# EAGLE design RELAY_BRD_V3 (EAGLE 7.4.0)
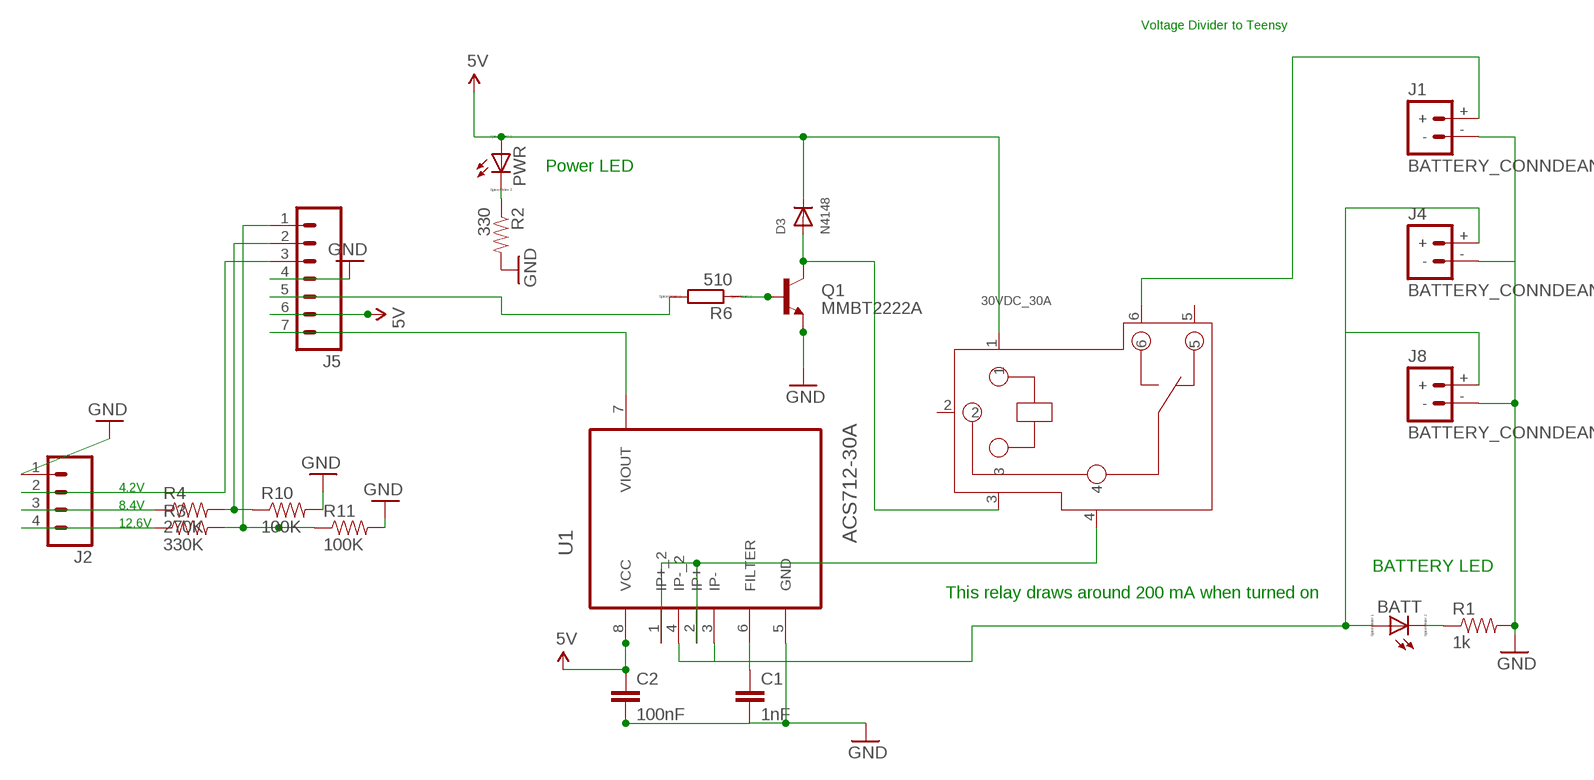
[diagram p0: schematic, sheet 1]

## Parts
30VDC_30A  RELAY-SLA-05VDC-SL-C  [6P-19.8H]
BATT  LED_E  [LED_1206]
C1  1nF  CAP1206  [1206]
C2  100nF  CAP1206  [1206]
D3  N4148  DIODEDO-1N4148  [DO-1N4148]
J1  BATTERY_CONNDEANS  [DEANS]
J2  M04POLAR  [MOLEX-1X4]
J4  BATTERY_CONNDEANS  [DEANS]
J5  M07LOCK_LONGPADS  [1X07_LOCK_LONGPADS]
J8  BATTERY_CONNDEANS  [DEANS]
PWR  LED_E  [LED_1206]
Q1  MMBT2222A  TRANSISTOR_NPNMMBT2222A  [SOT23-3]
R1  1k  RESISTOR1206  [1206]
R2  330  RESISTOR1206  [1206]
R3  330K  RESISTOR1206  [1206]
R4  270K  RESISTOR1206  [1206]
R6  510  RR1206  [R1206]
R10  100K  RESISTOR1206  [1206]
R11  100K  RESISTOR1206  [1206]
U1  ACS712-30A  ACS712ELCTR-20A-T  [SOIC127P600X175-8N]

## Nets
5V: 30VDC_30A.1 C2.1 D3.C J5.6 PWR.A U1.8(VCC)
11.1V_BATTERY: 30VDC_30A.6 J1.+
CURRENT_SENSE: J5.7 U1.7(VIOUT)
GND: C1.2 C2.2 J1.- J2.1 J4.- J5.4 J8.- Q1.2(E) R1.2 R2.2 R10.2 R11.2 U1.5(GND)
N$19: BATT.C R1.1
N$20: J5.5 R6.2
N$21: PWR.C R2.1
N$22: Q1.1(B) R6.1
N$23: 30VDC_30A.3 D3.A Q1.3(C)
N$24: J2.4 R3.1
N$26: BATT.A J4.+ J8.+ U1.3(IP-) U1.4(IP-_2)
N$27: J2.3 R4.1
N$68: C1.1 U1.6(FILTER)
N$69: J2.2 J5.3
N$70: 30VDC_30A.4 U1.1(IP+_2) U1.2(IP+)
N$84: J5.2 R4.2 R10.1
N$85: J5.1 R3.2 R11.1
Unconnected: 30VDC_30A.2 30VDC_30A.5

## Notes on the sheet
- Voltage Divider to Teensy
- Power LED
- 4.2V
- 8.4V
- 12.6V
- BATTERY LED
- This relay draws around 200 mA when turned on

## Library data of the parts
30VDC_30A = Grove ®C SPDT Relay(30A) v1.0:RELAY-SLA-05VDC-SL-C: · Up to 30A switching in SPST and 20A switching in spot arrangements. · Available as an open-frame relay, with a snap-on dust cover or with an immersion cleanable, plastic sealed case.
BATT PWR = eagle-ltspice:LED_E: LED Source: http://www.osram.convergy.de Source: www.luxeon.com Source: www.kingbright.com; SPICEMODEL: NONE; SPICEPREFIX: D; SPICETYPE: diode
C1 C2 = SparkFun-Capacitors:CAP: Capacitor Standard 0603 ceramic capacitor, and 0.1" leaded capacitor.
D3 = adafruit:DIODE: Diode SMADIODE - SMA Surface Mount Package 20V 1A Schottky Diode Digikey: 641-1014-6-ND DO-1N4148 - Through Hole Small Current Diode SOD-123 20V 1 A (.5mV Vf) Schottky Diode - Digikey: MBRX120TPMSCT-ND SOD-323 10V 570mA (.38mV Vf, 3ns) Schottky Diode - Digikey: ZLLS410CT-ND SOD-523 30V 30mA Schottky Diode (RB751S-40TE61) - Digikey: RB751S-40TE61CT-ND SOT23-R/W - SOT23 Package (R = Solder Paste/Reflow Ovens, W = Hand-Soldering) BAT54Film 40V 300mA - Digikey: 497-7162-1-ND
J1 J4 J8 = SparkFun-Connectors:BATTERY_CONN: Various footprints for battery connectors
J2 = SparkFun-Connectors:M04: Header 4 Standard 4-pin 0.1" header. Use with straight break away headers (SKU : PRT-00116), right angle break away headers (PRT-00553), swiss pins (PRT-00743), machine pins (PRT-00117), and female headers (PRT-00115). Molex polarized connector foot print use with SKU : PRT-08231 with associated crimp pins and housings. 1MM SMD Version SKU: PRT-10208
J5 = SparkFun-Connectors:M07: Header 7 Standard 7-pin 0.1" header. Use with straight break away headers (SKU : PRT-00116), right angle break away headers (PRT-00553), swiss pins (PRT-00743), machine pins (PRT-00117), and female headers (PRT-00115). NOTES ON THE VARIANTS LOCK and LOCK_LONGPADS... This footprint was designed to help hold the alignment of a through-hole component (i.e. 7-pin header) while soldering it into place. You may notice that each hole has been shifted either up or down by 0.005 of an inch from it's more standard position (which is usually a perfectly straight line). This slight alteration caused the pins (the squares in the middle) to touch the edges of the holes. Because they are alternating, it causes a "brace" to hold the header in place. 0.005 has proven to be the perfect amount of "off-center" position when using our standard breakaway headers. Although looks a little odd when you look at the bare footprint, once you have a header in there, the alteration is very hard to notice. Also, if you push a header all the way into place, it is covered up entirely on the bottom side. This idea of altering the position of holes to aid alignment will be further integrated into the Sparkfun Library for other footprints. It can help hold any component with 3 or more connection pins.
Q1 = SparkFun-DiscreteSemi:TRANSISTOR_NPN: Generic NPN BJT MMBT2222A - TRANS-08049 (SOT-23, 1A 40V) MPSA42 - TRANS-09116 (SOT-23, 500mA 300V) MMBT5088LT1G - TRANS-11160 (SOT-23, 50 mA 30V) BC547 - COM-08928 <http://www.sparkfun.com/products/8928> (TO-92 45V 100mA) (1.Collector 2.Base 3.Emitter) 2N3904 - COM-00521 <http://www.sparkfun.com/products/521> (TO-92 40V 200mA) (1.Emitter 2.Base 3.Collector) P2N2222A - COM-12852 <http://www.sparkfun.com/products/12852> (TO-92 40V 600mA) (1.Collector 2.Base 3.Emitter); PROD_ID: TRANS-08049
R1-R4 R10 R11 = SparkFun-Resistors:RESISTOR: Resistor Basic schematic elements and footprints for 0603, 1206, and PTH resistors.
R6 = eagle-ltspice:R: RESISTOR, European symbol; SPICEMODEL: NONE; SPICEPREFIX: R
U1 = Allegro_By_element14_Batch_1:ACS712ELCTR-20A-T: Linear Current Sensor; MPN: ACS712ELCTR-20A-T; OC_FARNELL: 1329624; OC_NEWARK: 31M3133; PACKAGE: SOIC-8; SUPPLIER: Allegro

## Board
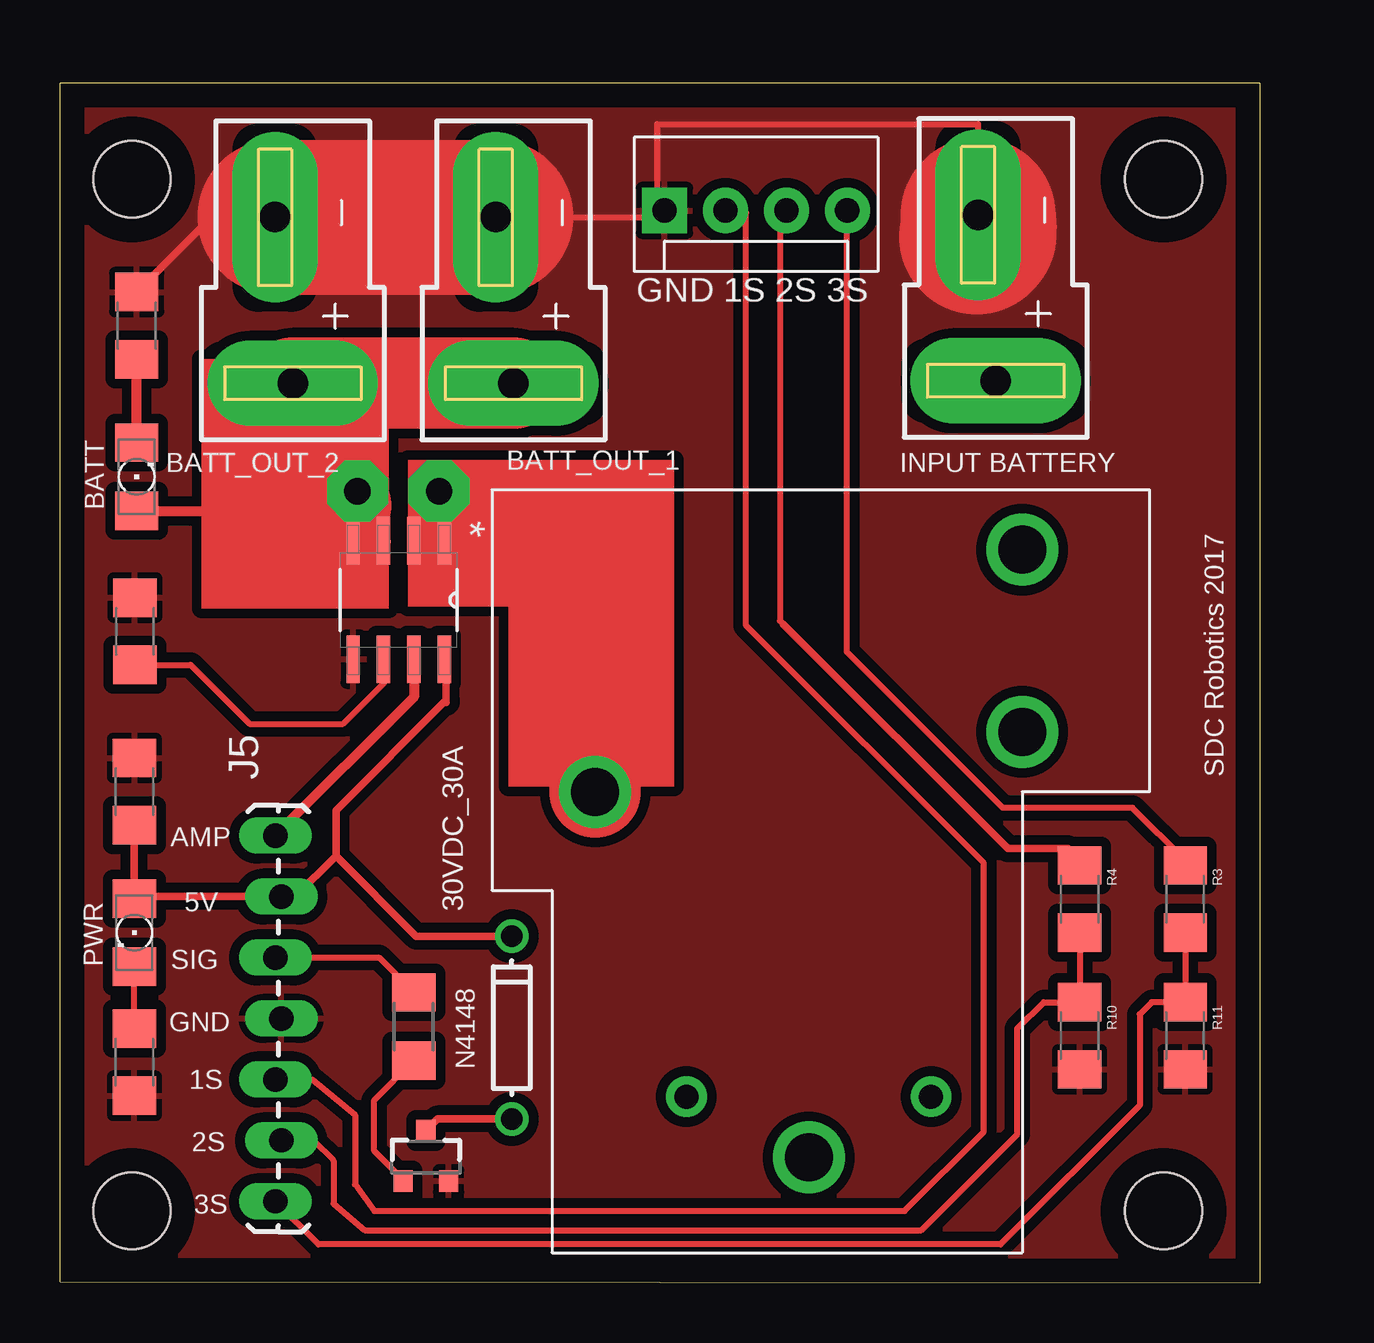
[diagram p1: board, top side]
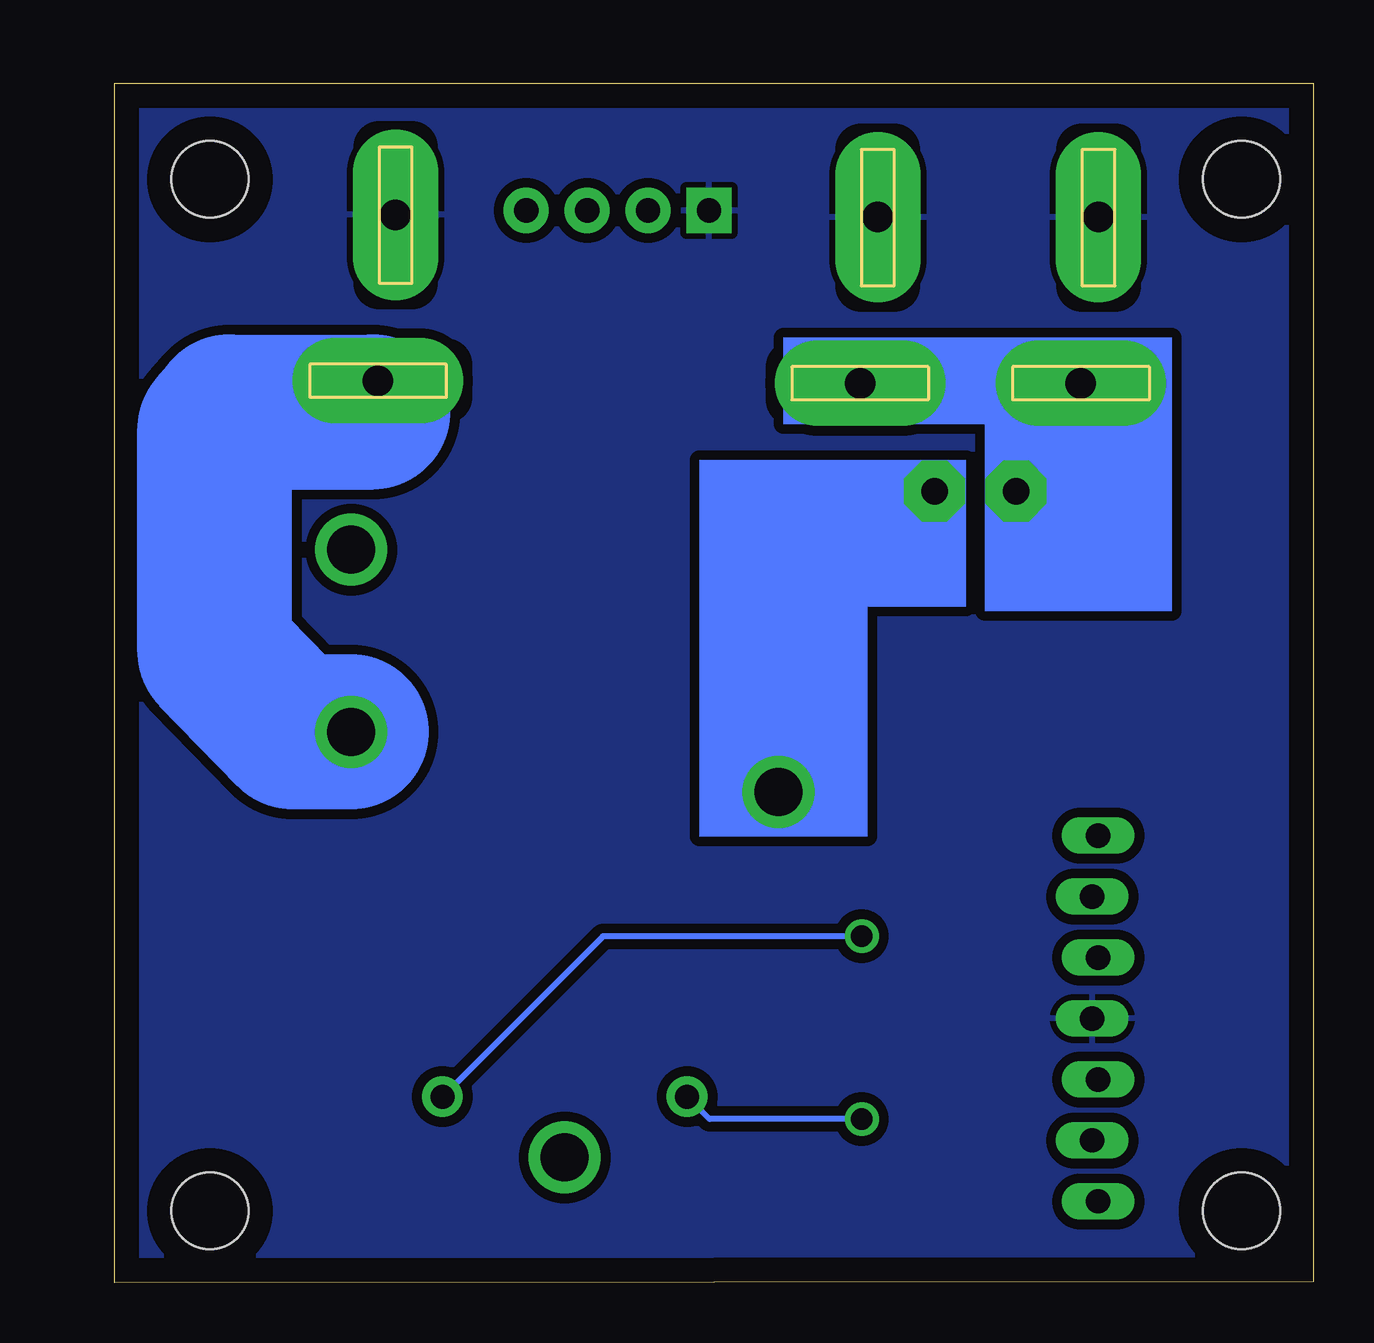
[diagram p2: board, bottom side, seen from below]

Size 50 x 50 mm. Coordinates in mm from the lower left corner, seen from the top.
Outline: 0,0.05 50,0 50,50 0,50 0,0.05
Copper layers (1*16): Top 0.035mm / dielectric 1.5mm / Bottom 0.035mm
Design rules "default *": minimum track width 10mil, minimum drill 24mil, track to track 16mil, track to pad 16mil, pad to pad 8mil, via to via 8mil, smd to smd 8mil, copper to edge 40mil, drill to drill 8mil, minimum pad ring 10mil, minimum via ring 8mil, stop-mask expansion 4mil, vias tented up to drill 0mil, thermal gap 10mil
Holes 3.2 mm at 3,46 46,46 46,3 3,3

### Footprints (pad centres in the part's own frame; a part is rotated, then mirrored left to right if it is on the bottom)
6P-19.8H = drill 1 pad 1.7: 1 -9.4,-4.6; 3 -9.4,5.6 | drill 2 pad 3: 2 -11.94,0.5; 4 3.3,9.4; 5 13.4,-8.4; 6 5.8,-8.4
LED_1206 = smd 1.6 x 1.803: A -1.422,0; C 1.422,0
1206 = smd 1.6 x 1.8: 1 -1.4,0; 2 1.4,0
DO-1N4148 = drill 0.9: A -3.81,0; C 3.81,0
DEANS = drill 1.27 pad 3.556 long: + 0,0; - 0.737,-6.921
MOLEX-1X4 = drill 1.016 pad 1.88 square: 1 0,0 | drill 1.016 pad 1.88: 2 2.54,0; 3 5.08,0; 4 7.62,0
1X07_LOCK_LONGPADS = drill 1.016 long: 1 0,0.127; 2 2.54,-0.127; 3 5.08,0.127; 4 7.62,-0.127; 5 10.16,0.127; 6 12.7,-0.127; 7 15.24,0.127
SOT23-3 = smd 0.8 x 0.9: 1 -0.95,-1; 2 0.95,-1; 3 0,1.1
R1206 = smd 1.6 x 1.803: 1 -1.422,0; 2 1.422,0
SOIC127P600X175-8N = smd 1.981 x 0.559: 1 -2.464,1.905; 2 -2.464,0.635; 3 -2.464,-0.635; 4 -2.464,-1.905; 5 2.464,-1.905; 6 2.464,-0.635; 7 2.464,0.635; 8 2.464,1.905

### Placement (x,y rotation side)
30VDC_30A  31.71,17.16 90 top
BATT  3.2,33.6 90 top
C1  3.12,27.16 90 top
C2  3.11,20.48 90 top
D3  18.83,10.64 90 top
J1  39,37.6 180 top
J2  25.2,44.7 0 top
J4  18.9,37.5 180 top
J5  9.1,3.4 90 top
J8  9.7,37.5 180 top
PWR  3.1,14.6 270 top
Q1  15.25,5.24 0 top
R1  3.2,39.9 90 top
R2  3.1,9.2 270 top
R3  46.9,16 270 top
R4  42.5,16 270 top
R6  14.75,10.69 90 top
R10  42.5,10.3 270 top
R11  46.9,10.3 270 top
U1  14.12,28.46 270 top

### Tracks (layer width: path | path; a pad name or v marks a point on that pad's centre or on a via)
5V
  Top 0.305: 3.13,19.1 C2.1 3.1,18.98 PWR.A 3.18,16.1 J5.6 9.8,16.1 11.5,17.8 | 16.1,24.2 16.1,24.3 | 16.1,24.3 16.1,26.62 U1.8 | 11.5,17.8 11.5,19.7 16.1,24.3 | D3.C 14.85,14.45 11.5,17.8
  Bottom 0.254: D3.C 29.63,14.45 30VDC_30A.1
11.1V_BATTERY
  Bottom 1.27: 39.2,36.3 39.2,37.4 J1.+
  Bottom 6.452: 30VDC_30A.6 42.56,22.96 45.8,26.3 45.8,35.6 45.2,36.3 39.2,36.3
CURRENT_SENSE
  Top 0.406: U1.7 14.76,24.42 J5.7
GND
  Top 0.254: J1.- 38.26,48.3 24.9,48.3 24.9,45 J2.1 24.92,44.42 J4.-
  Top 0.305: J8.- 6.12,44.22 R1.2 | 36.61,43.64 36.7,43.7
  Top 1.27: 38.2,43.6 36.7,43.6 36.63,43.67 36.63,43.66 36.61,43.64
  Top 6.452: J8.- J4.- | J1.- 38.32,43.72 38.2,43.6
  pour Top: -1.6,52.3 52.3,52.1 52.3,-2.4 -1.6,-2.2
  pour Bottom: -3.1,51.3 52.2,51.3 52.2,-5.4 -3.1,-5.4 -3.1,51.2
N$19
  Top 0.406: BATT.C R1.1
N$20
  Top 0.254: J5.5 13.3,13.56 R6.2
N$21
  Top 0.254: R2.1 PWR.C
N$22
  Top 0.254: Q1.1 14.3,4.3 13.1,5.5 13.1,7.62 R6.1
N$23
  Top 0.305: D3.A 15.73,6.83 Q1.3
  Bottom 0.254: D3.A 25.17,6.83 30VDC_30A.3
N$24
  Top 0.254: R3.1 46.9,17.6 44.7,19.8 39.3,19.8 32.8,26.3 32.8,44.6 32.82,44.62 J2.4
N$26
  Top 0.254: 13.49,30.9 U1.3 | 12.4,31.6 U1.4
  Top 0.406: BATT.A 8.58,32.18 10.35,33.95
  Top 0.61: 13.49,30.9 12.34,30.9 U1.4
  Top 1.27: 12.4,31.6 12.4,31.3 13.1,30.6 12.1,30.6 12.1,31 12.3,31.2 12.3,32 11.9,32.4
  Top 3.81: 11.9,32.4 10.35,33.95 9.7,34.6 J8.+ J4.+
N$27
  Top 0.254: J2.3 30.28,44.68 30,44.4 30,27.6 30.16,27.44
  Top 0.305: 30.16,27.44 39.5,18.1 42,18.1 R4.1
N$68
  Top 0.254: C1.1 5.44,25.76 7.9,23.3 11.8,23.3 13.5,25 13.5,25.98 U1.6
N$69
  Top 0.254: J5.3 10.52,8.48 12.3,7 12.3,4.1 13.1,3 35.2,3 38.5,6.3 38.5,17.5 28.6,27.4 28.6,44.6 28.5,44.7 J2.2
N$70
  Top 0.254: 15.21,31.2 U1.2 U1.1
  Top 1.27: 16.7,32.1 16.3,31.9 U1.1
  Top 3.81: 30VDC_30A.4 22.31,29.39 19.8,32.1 16.7,32.1
N$81  (via drill 1.1 pad 2.54)
  other vias: 12.4,33
N$84
  Top 0.254: R4.2 R10.1 41,11.7 39.9,10.6 39.9,6.2 35.9,2.2 12.7,2.2 11.4,3.3 11.4,5.1 10.56,5.94 J5.2
N$85
  Top 0.254: R3.2 R11.1 45.5,11.7 45,11.2 45,7.4 39.2,1.6 10.77,1.6 J5.1
N$86  (via drill 1.1 pad 2.54)
  other vias: 15.8,33
(copper drawn outside any net)
  shapes: Bottom area x4, Top area x3

### Text on the board
tNames: GND 1S 2S 3S | BATT_OUT_2 | BATT_OUT_1 | INPUT BATTERY | SDC Robotics 2017 | AMP | 5V | SIG | GND | 1S | 2S | 3S